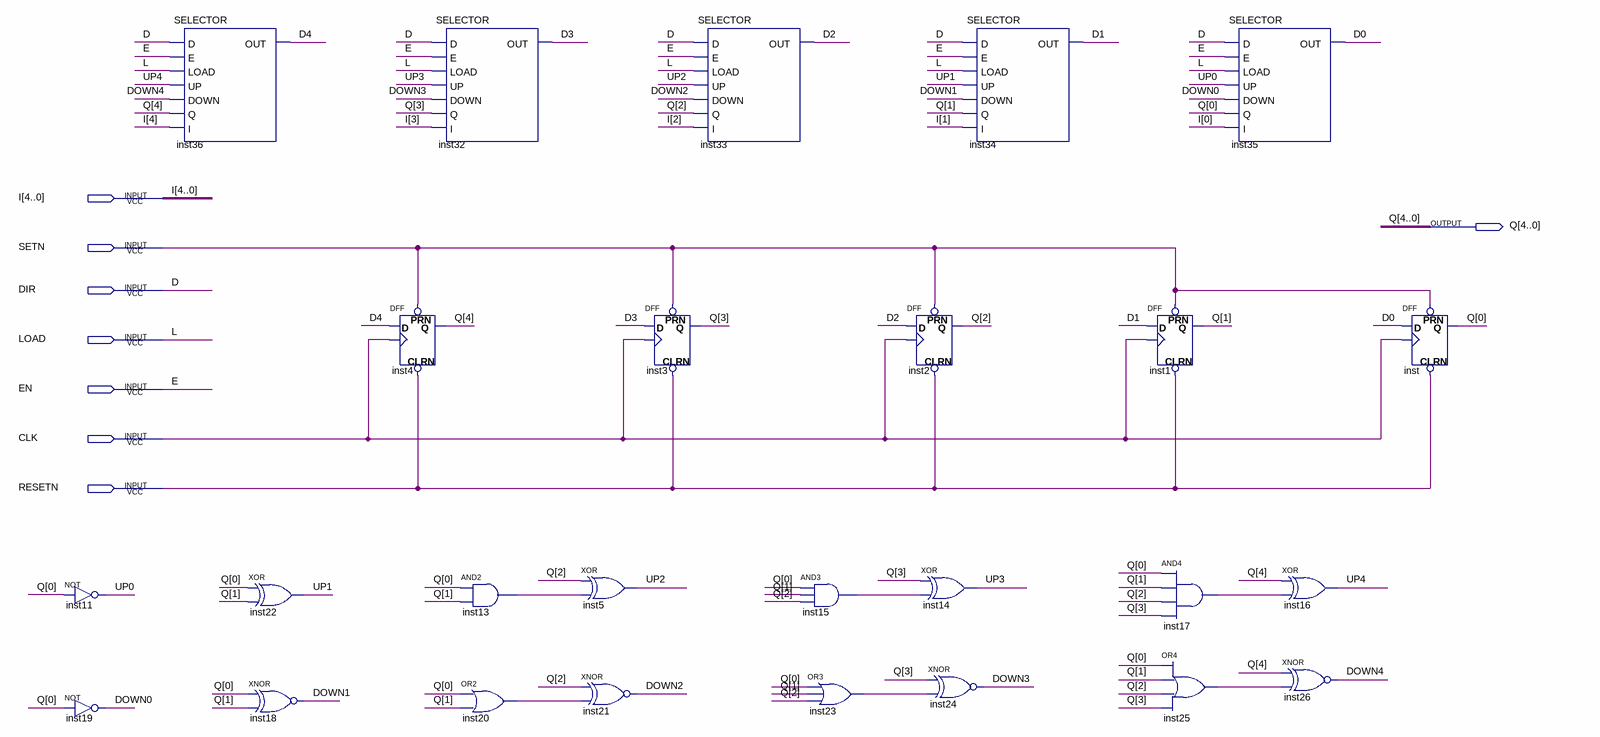
[diagram p0: schematic sheet]
// Quartus schematic BCD_5bit_up_down.bdf as structural Verilog: 26 symbols, 8 pins
module BCD_5bit_up_down (
  input  [4:0] I,
  input  SETN,
  input  DIR,
  input  LOAD,
  input  EN,
  input  CLK,
  input  RESETN,
  output [4:0] Q
);

  wire D0, D1, D2, D3, D4, DOWN0, DOWN1, DOWN2, DOWN3, DOWN4, inst13_out, inst15_out, inst17_out, inst20_out,
       inst23_out, inst25_out, UP0, UP1, UP2, UP3, UP4;

  not inst11 (UP0, Q[0]);
  not inst19 (DOWN0, Q[0]);
  SELECTOR inst36 (.D(DIR), .E(EN), .LOAD(LOAD), .UP(UP4), .DOWN(DOWN4), .Q(Q[4]), .I(I[4]), .OUT(D4));
  xor inst22 (UP1, Q[0], Q[1]);
  xnor inst18 (DOWN1, Q[0], Q[1]);
  DFF inst4 (.CLRN(RESETN), .CLK(CLK), .D(D4), .PRN(SETN), .Q(Q[4]));
  SELECTOR inst32 (.D(DIR), .E(EN), .LOAD(LOAD), .UP(UP3), .DOWN(DOWN3), .Q(Q[3]), .I(I[3]), .OUT(D3));
  and inst13 (inst13_out, Q[0], Q[1]);
  or inst20 (inst20_out, Q[0], Q[1]);
  xor inst5 (UP2, Q[2], inst13_out);
  xnor inst21 (DOWN2, Q[2], inst20_out);
  DFF inst3 (.CLRN(RESETN), .CLK(CLK), .D(D3), .PRN(SETN), .Q(Q[3]));
  SELECTOR inst33 (.D(DIR), .E(EN), .LOAD(LOAD), .UP(UP2), .DOWN(DOWN2), .Q(Q[2]), .I(I[2]), .OUT(D2));
  and inst15 (inst15_out, Q[0], Q[1], Q[2]);
  or inst23 (inst23_out, Q[0], Q[1], Q[2]);
  DFF inst2 (.CLRN(RESETN), .CLK(CLK), .D(D2), .PRN(SETN), .Q(Q[2]));
  SELECTOR inst34 (.D(DIR), .E(EN), .LOAD(LOAD), .UP(UP1), .DOWN(DOWN1), .Q(Q[1]), .I(I[1]), .OUT(D1));
  xor inst14 (UP3, Q[3], inst15_out);
  xnor inst24 (DOWN3, Q[3], inst23_out);
  DFF inst1 (.CLRN(RESETN), .CLK(CLK), .D(D1), .PRN(SETN), .Q(Q[1]));
  and inst17 (inst17_out, Q[0], Q[1], Q[2], Q[3]);
  or inst25 (inst25_out, Q[0], Q[1], Q[2], Q[3]);
  SELECTOR inst35 (.D(DIR), .E(EN), .LOAD(LOAD), .UP(UP0), .DOWN(DOWN0), .Q(Q[0]), .I(I[0]), .OUT(D0));
  xor inst16 (UP4, Q[4], inst17_out);
  xnor inst26 (DOWN4, Q[4], inst25_out);
  DFF inst (.CLRN(RESETN), .CLK(CLK), .D(D0), .PRN(SETN), .Q(Q[0]));

  // Other names for the same wires on the sheet: D = DIR; E = EN; L = LOAD
endmodule
